# Altium schematic sheet Watch_Input.SchDoc
size A; SheetNumber: 1; SheetTotal: 1
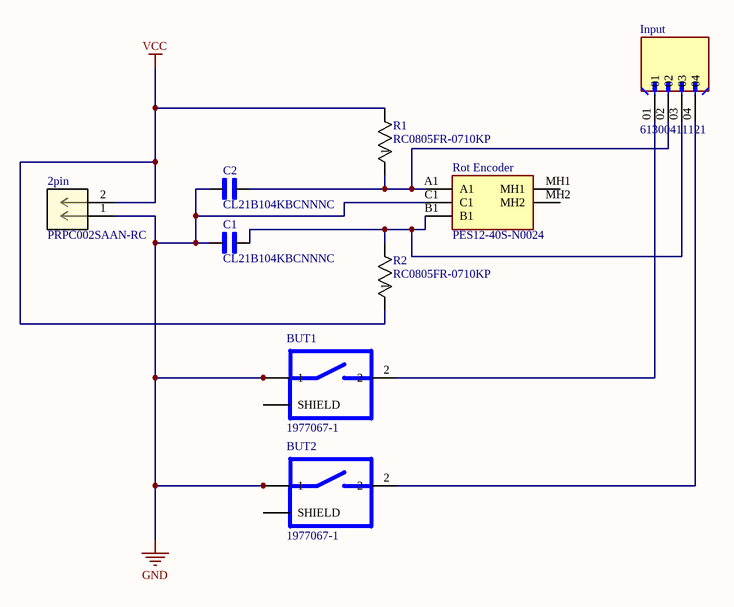
[diagram p0: Watch_Input.SchDoc]

## Parts
2pin  PRPC002SAAN-RC  [CONN_PRPC002SAAN-RC_SUL]
BUT1  1977067-1  [TE_1977067-1]
BUT2  1977067-1  [TE_1977067-1]
C1  CL21B104KBCNNNC  [CAPC2012X95N]
C2  CL21B104KBCNNNC  [CAPC2012X95N]
Input  61300411121  [WURTH_61300411121]
R1  RC0805FR-0710KP  [RES_RC0805_2X1P25_YAG]
R2  RC0805FR-0710KP  [RES_RC0805_2X1P25_YAG]
Rot_Encoder  PES12-40S-N0024  [PES1240SN0024]

## Nets
GND: 2pin.1 BUT1.1 BUT1.3 BUT2.1 BUT2.3 C1.1 C2.1 Rot_Encoder.C1
VCC: 2pin.2 R1.2 R2.1
NetBUT1_2: BUT1.2 Input.01
NetBUT1_P1: BUT1.P1(SHIELD) BUT1.P2(SHIELD)
NetBUT2_2: BUT2.2 Input.04
NetBUT2_P1: BUT2.P1(SHIELD) BUT2.P2(SHIELD)
NetC1_2: C1.2 Input.03 R2.2 Rot_Encoder.B1
NetC2_2: C2.2 Input.02 R1.1 Rot_Encoder.A1

Not connected (* = marked no-connect by the designer): Rot_Encoder MH1 MH2

## Library data of the parts
2pin = PRPC002SAAN-RC: CONN HEADER .100 SNGL STR 2POS; Manufacturer_Name: Sullins; Copyright: Copyright (C) 2025 Ultra Librarian. All rights reserved.; Manufacturer_Part_Number: PRPC002SAAN-RC; RefDes: RefDes; Type: Type
BUT1 BUT2 = 1977067-1: Switch Tactile OFF (ON) SPST Round Button Gull Wing 0.05A 12VDC 100000Cycles 1.57N SMD T/R; MF: TE Connectivity; MP: 1977067-1; Price: None; Package: None; Check_prices: https://www.snapeda.com/parts/1977067-1/TE%20Connectivity%20ALCOSWITCH%20Switches/view-part/2191392/?ref=eda; Value: *; Availability: Warning; SnapEDA_Link: https://www.snapeda.com/parts/1977067-1/TE%20Connectivity%20ALCOSWITCH%20Switches/view-part/2191392/?ref=snap
C1 C2 = CL21B104KBCNNNC: 0.1 ÂµF Â±10% 50V Ceramic Capacitor X7R 0805 (2012 Metric); MF: Samsung Electro-Mechanics; SnapEDA_Link: https://www.snapeda.com/parts/CL21B104KBCNNNC/Samsung/view-part/?ref=snap; Package: SMD-2 Samsung; Value: *; MP: CL21B104KBCNNNC; Check_prices: https://www.snapeda.com/parts/CL21B104KBCNNNC/Samsung/view-part/?ref=eda
Input = 61300411121: Connector Header Through Hole 4 position 0.100 (2.54mm); MF: WÃ¼rth Elektronik; SnapEDA_Link: https://www.snapeda.com/parts/61300411121/W%25C3%25BCrth+Elektronik+Midcom/view-part/?ref=snap; Package: None; Value: *; MP: 61300411121; Check_prices: https://www.snapeda.com/parts/61300411121/W%25C3%25BCrth+Elektronik+Midcom/view-part/?ref=eda
R1 R2 = RC0805FR-0710KP: No Description Available; Manufacturer_Name: Yageo; Copyright: Copyright (C) 2025 Ultra Librarian. All rights reserved.; Manufacturer_Part_Number: RC0805FR-0710KP
Rot_Encoder = PES12-40S-N0024: ENCODER ROTARY; Manufacturer_Name: Bourns; Geometry.Height: 8.5mm; Mouser Part Number: 652-PES12-40S-N0024; Mouser Price/Stock: https://www.mouser.co.uk/ProductDetail/Bourns/PES12-40S-N0024?qs=9fn1gpisni7PBzk9dl6VPg%3D%3D; Manufacturer_Part_Number: PES12-40S-N0024; Datasheet Link: https://www.bourns.com/docs/Product-Datasheets/PES12.pdf